# Altium schematic sheet Master_sheet.SchDoc
size A4; SheetNumber: 1; SheetTotal: 1
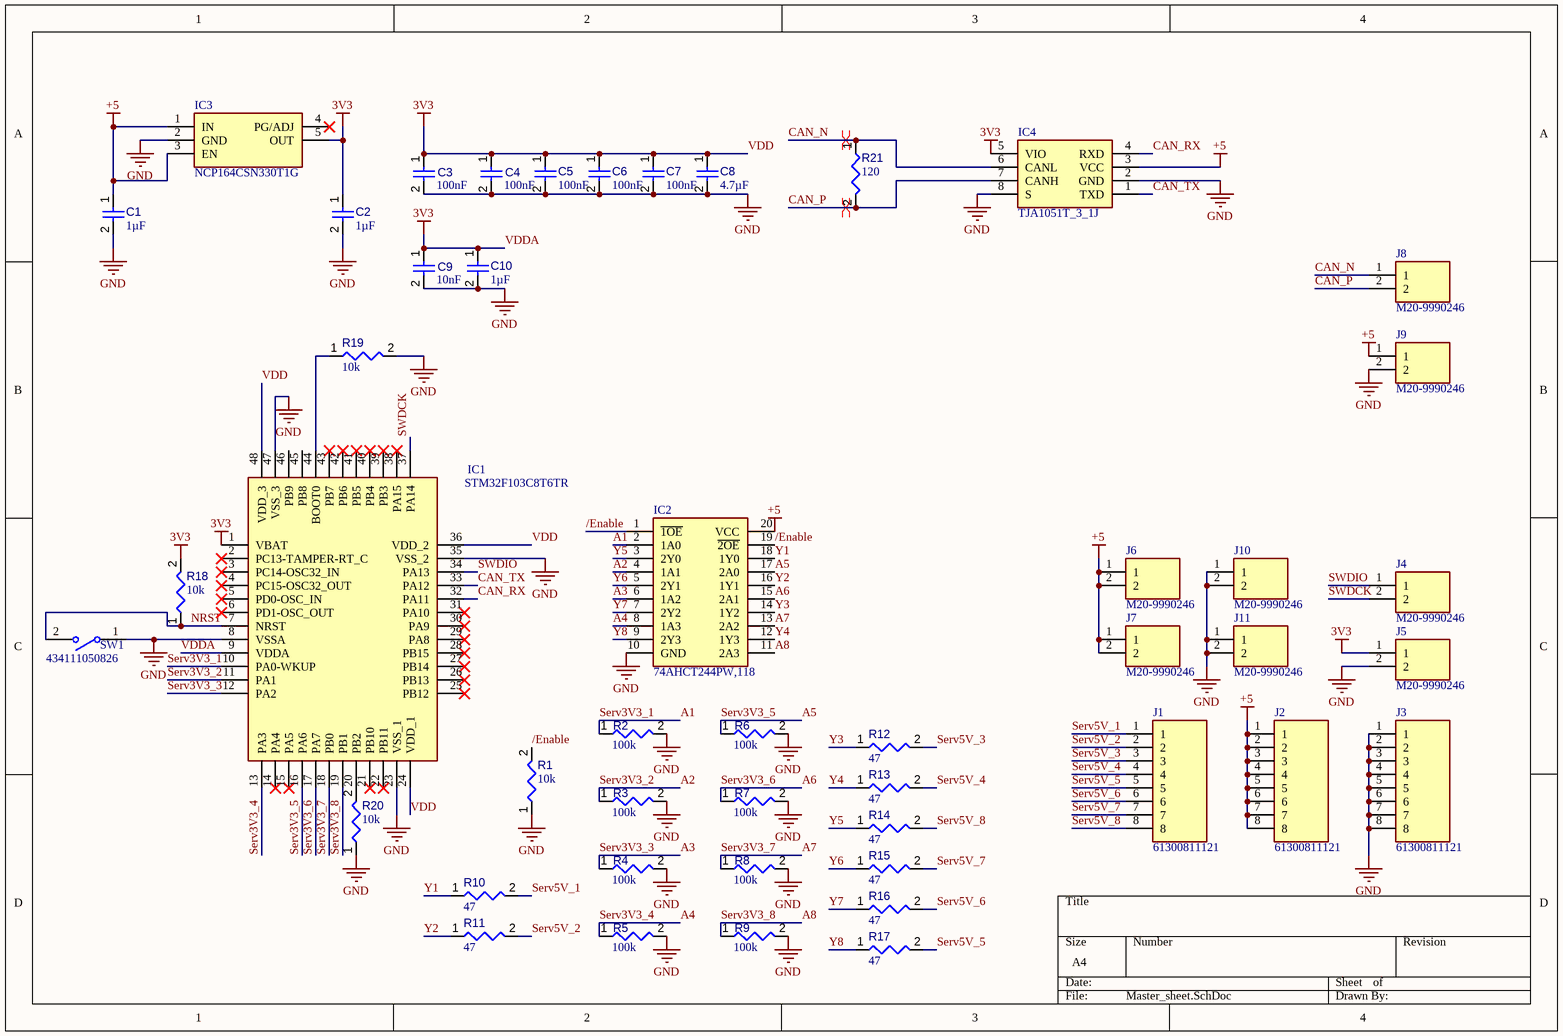
[diagram p0: Master_sheet.SchDoc]

## Parts
C1  value 1µF  [CAPC1608X94X35NL15T15]  (hidden comment: Capacitor 1 uF +/- 10% 16 V 0603)
C2  value 1µF  [CAPC1608X94X35NL15T15]  (hidden comment: Capacitor 1 uF +/- 10% 16 V 0603)
C3  value 100nF  [CAPC1608X94X35NL15T15]  (hidden comment: Capacitor 1 uF +/- 10% 16 V 0603)
C4  value 100nF  [CAPC1608X94X35NL15T15]  (hidden comment: Capacitor 1 uF +/- 10% 16 V 0603)
C5  value 100nF  [CAPC1608X94X35NL15T15]  (hidden comment: Capacitor 1 uF +/- 10% 16 V 0603)
C6  value 100nF  [CAPC1608X94X35NL15T15]  (hidden comment: Capacitor 1 uF +/- 10% 16 V 0603)
C7  value 100nF  [CAPC1608X94X35NL15T15]  (hidden comment: Capacitor 1 uF +/- 10% 16 V 0603)
C8  value 4.7µF  [CAPC1608X94X35NL15T15]  (hidden comment: Capacitor 1 uF +/- 10% 16 V 0603)
C9  value 10nF  [CAPC1608X94X35NL15T15]  (hidden comment: Capacitor 1 uF +/- 10% 16 V 0603)
C10  value 1µF  [CAPC1608X94X35NL15T15]  (hidden comment: Capacitor 1 uF +/- 10% 16 V 0603)
IC1  STM32F103C8T6TR  [QFP50P900X900X160-48N]
IC2  74AHCT244PW,118  [SOP65P640X110-20N]
IC3  NCP164CSN330T1G  [SOT95P275X110-5N]
IC4  TJA1051T_3_1J  [SOIC127P600X175-8N]
J1  61300811121  [HDRV8W64P0X254_1X8_2032X254X854P]
J2  61300811121  [HDRV8W64P0X254_1X8_2032X254X854P]
J3  61300811121  [HDRV8W64P0X254_1X8_2032X254X854P]
J4  M20-9990246  [HDRV2W66P0X254_1X2_508X254X874P]
J5  M20-9990246  [HDRV2W66P0X254_1X2_508X254X874P]
J6  M20-9990246  [HDRV2W66P0X254_1X2_508X254X874P]
J7  M20-9990246  [HDRV2W66P0X254_1X2_508X254X874P]
J8  M20-9990246  [HDRV2W66P0X254_1X2_508X254X874P]
J9  M20-9990246  [HDRV2W66P0X254_1X2_508X254X874P]
J10  M20-9990246  [HDRV2W66P0X254_1X2_508X254X874P]
J11  M20-9990246  [HDRV2W66P0X254_1X2_508X254X874P]
R1  value 10k  [RESC1608X55X25ML10T15]  (hidden comment: Resistor 100k +/-1% 0603 100 mW)
R2  value 100k  [RESC1608X55X25ML10T15]  (hidden comment: Resistor 100k +/-1% 0603 100 mW)
R3  value 100k  [RESC1608X55X25ML10T15]  (hidden comment: Resistor 100k +/-1% 0603 100 mW)
R4  value 100k  [RESC1608X55X25ML10T15]  (hidden comment: Resistor 100k +/-1% 0603 100 mW)
R5  value 100k  [RESC1608X55X25ML10T15]  (hidden comment: Resistor 100k +/-1% 0603 100 mW)
R6  value 100k  [RESC1608X55X25ML10T15]  (hidden comment: Resistor 100k +/-1% 0603 100 mW)
R7  value 100k  [RESC1608X55X25ML10T15]  (hidden comment: Resistor 100k +/-1% 0603 100 mW)
R8  value 100k  [RESC1608X55X25ML10T15]  (hidden comment: Resistor 100k +/-1% 0603 100 mW)
R9  value 100k  [RESC1608X55X25ML10T15]  (hidden comment: Resistor 100k +/-1% 0603 100 mW)
R10  value 47  [RESC1608X55X25ML10T15]  (hidden comment: Resistor 100k +/-1% 0603 100 mW)
R11  value 47  [RESC1608X55X25ML10T15]  (hidden comment: Resistor 100k +/-1% 0603 100 mW)
R12  value 47  [RESC1608X55X25ML10T15]  (hidden comment: Resistor 100k +/-1% 0603 100 mW)
R13  value 47  [RESC1608X55X25ML10T15]  (hidden comment: Resistor 100k +/-1% 0603 100 mW)
R14  value 47  [RESC1608X55X25ML10T15]  (hidden comment: Resistor 100k +/-1% 0603 100 mW)
R15  value 47  [RESC1608X55X25ML10T15]  (hidden comment: Resistor 100k +/-1% 0603 100 mW)
R16  value 47  [RESC1608X55X25ML10T15]  (hidden comment: Resistor 100k +/-1% 0603 100 mW)
R17  value 47  [RESC1608X55X25ML10T15]  (hidden comment: Resistor 100k +/-1% 0603 100 mW)
R18  value 10k  [RESC1608X55X25ML10T15]  (hidden comment: Resistor 100k +/-1% 0603 100 mW)
R19  value 10k  [RESC1608X55X25ML10T15]  (hidden comment: Resistor 100k +/-1% 0603 100 mW)
R20  value 10k  [RESC1608X55X25ML10T15]  (hidden comment: Resistor 100k +/-1% 0603 100 mW)
R21  value 120  [RESC1608X55X25ML10T15]  (hidden comment: Resistor 100k +/-1% 0603 100 mW)
SW1  434111050826  [434111050826]

## Nets
+5: C1.1 IC2.20(VCC) IC3.1(IN) IC3.3(EN) IC4.3(VCC) J2.1 J2.2 J2.3 J2.4 J2.5 J2.6 J2.7 J2.8 J6.1 J6.2 J7.1 J7.2 J9.1
GND: C1.2 C2.2 C3.2 C4.2 C5.2 C6.2 C7.2 C8.2 C9.2 C10.2 IC1.8(VSSA) IC1.23(VSS_1) IC1.35(VSS_2) IC1.47(VSS_3) IC2.10(GND) IC3.2(GND) IC4.2(GND) IC4.8(S) J3.1 J3.2 J3.3 J3.4 J3.5 J3.6 J3.7 J3.8 J5.2 J9.2 J10.1 J10.2 J11.1 J11.2 R1.1 R2.2 R3.2 R4.2 R5.2 R6.2 R7.2 R8.2 R9.2 R19.2 R20.1 SW1.1
VDD: C2.1 C3.1 C4.1 C5.1 C6.1 C7.1 C8.1 C9.1 C10.1 IC1.1(VBAT) IC1.9(VDDA) IC1.24(VDD_1) IC1.36(VDD_2) IC1.48(VDD_3) IC3.5(OUT) IC4.5(VIO) J5.1 R18.2  [also labelled 3V3, VDDA]
/Enable: IC2.1(~{1OE}) IC2.19(~{2OE}) R1.2
A1: IC1.10(PA0-WKUP) IC2.2(1A0) R2.1  [also labelled Serv3V3_1]
A2: IC1.11(PA1) IC2.4(1A1) R3.1  [also labelled Serv3V3_2]
A3: IC1.12(PA2) IC2.6(1A2) R4.1  [also labelled Serv3V3_3]
A4: IC1.13(PA3) IC2.8(1A3) R5.1  [also labelled Serv3V3_4]
A5: IC1.16(PA6) IC2.17(2A0) R6.1  [also labelled Serv3V3_5]
A6: IC1.17(PA7) IC2.15(2A1) R7.1  [also labelled Serv3V3_6]
A7: IC1.18(PB0) IC2.13(2A2) R8.1  [also labelled Serv3V3_7]
A8: IC1.19(PB1) IC2.11(2A3) R9.1  [also labelled Serv3V3_8]
CAN_N: IC4.6(CANL) J8.1 R21.1
CAN_P: IC4.7(CANH) J8.2 R21.2
CAN_RX: IC1.32(PA11) IC4.4(RXD)
CAN_TX: IC1.33(PA12) IC4.1(TXD)
NRST: IC1.7(NRST) R18.1 SW1.2
Serv5V_1: J1.1 R10.2
Serv5V_2: J1.2 R11.2
Serv5V_3: J1.3 R12.2
Serv5V_4: J1.4 R13.2
Serv5V_5: J1.5 R17.2
Serv5V_6: J1.6 R16.2
Serv5V_7: J1.7 R15.2
Serv5V_8: J1.8 R14.2
SWDCK: IC1.37(PA14) J4.2
SWDIO: IC1.34(PA13) J4.1
Y1: IC2.18(1Y0) R10.1
Y2: IC2.16(1Y1) R11.1
Y3: IC2.14(1Y2) R12.1
Y4: IC2.12(1Y3) R13.1
Y5: IC2.3(2Y0) R14.1
Y6: IC2.5(2Y1) R15.1
Y7: IC2.7(2Y2) R16.1
Y8: IC2.9(2Y3) R17.1
NetIC1_20: IC1.20(PB2) R20.2
NetIC1_44: IC1.44(BOOT0) R19.1

Not connected (* = marked no-connect by the designer): IC1 2(PC13-TAMPER-RT_C)* 3(PC14-OSC32_IN)* 4(PC15-OSC32_OUT)* 5(PD0-OSC_IN)* 6(PD1-OSC_OUT)* 14(PA4)* 15(PA5)* 21(PB10)* 22(PB11)* 25(PB12)* 26(PB13)* 27(PB14)* 28(PB15)* 29(PA8)* 30(PA9)* 31(PA10)* 38(PA15)* 39(PB3)* 40(PB4)* 41(PB5)* 42(PB6)* 43(PB7)* 45(PB8) 46(PB9); IC3 4(PG/ADJ)*

## Layout directives
differential pair: CAN_N, CAN_P

## Library data of the parts
C1-C10 = CMP-001-00003-6: Chip Capacitor, 1 uF, +/- 10%, 16 V, 0603 (1608 Metric); Voltage Rating: 16V; Capacitor Type: Ceramic; Max Operating Temperature: 125°C; Pins: 2; Tolerance: 10%; Min Operating Temperature: -55°C; RoHS Compliant: True; Mounting Technology: SM; Case/Package: 0603
IC1 = STM32F103C8T6TR: Integrated Circuit; Manufacturer_Name: STMicroelectronics; Datasheet Link: http://media.digikey.com/pdf/Data%20Sheets/ST%20Microelectronics%20PDFS/STM32F103x8,B.pdf; Height: 1.6mm; Manufacturer_Part_Number: STM32F103C8T6TR; Mouser Part Number: 511-STM32F103C8T6TR; Mouser Price/Stock: https://www.mouser.co.uk/ProductDetail/STMicroelectronics/STM32F103C8T6TR?qs=5HwTSiuA5HDxFj62n06yag%3D%3D; Arrow Part Number: STM32F103C8T6TR; Arrow Price/Stock: https://www.arrow.com/en/products/stm32f103c8t6tr/stmicroelectronics?utm_currency=USD&region=nac
IC2 = 74AHCT244PW,118: Integrated Circuit; Manufacturer_Name: Nexperia; Datasheet Link: https://assets.nexperia.com/documents/data-sheet/74AHC_AHCT244.pdf; Height: 1.1mm; Manufacturer_Part_Number: 74AHCT244PW,118; Mouser Part Number: 771-AHCT244PW118; Mouser Price/Stock: https://www.mouser.co.uk/ProductDetail/Nexperia/74AHCT244PW118?qs=P62ublwmbi%252BwpHKVMKyyhA%3D%3D; Arrow Part Number: 74AHCT244PW,118; Arrow Price/Stock: https://www.arrow.com/en/products/74ahct244pw118/nexperia?region=nac
IC3 = NCP164CSN330T1G: Integrated Circuit; Manufacturer_Name: onsemi; Datasheet Link: https://componentsearchengine.com/Datasheets/2/NCP164CSN330T1G.pdf; Height: 1.1mm; Manufacturer_Part_Number: NCP164CSN330T1G; Mouser Part Number: 863-NCP164CSN330T1G; Mouser Price/Stock: https://www.mouser.co.uk/ProductDetail/onsemi/NCP164CSN330T1G?qs=xZ%2FP%252Ba9zWqbi%2FAyy5UtoRw%3D%3D; Arrow Part Number: NCP164CSN330T1G; Arrow Price/Stock: https://www.arrow.com/en/products/ncp164csn330t1g/on-semiconductor?utm_currency=USD&region=nac
IC4 = TJA1051T_3_1J: Integrated Circuit; Manufacturer_Name: NXP; Manufacturer_Part_Number: TJA1051T/3/1J; Datasheet Link: http://www.nxp.com/docs/en/data-sheet/TJA1051.pdf; Height: 1.75mm; Mouser Part Number: 771-TJA1051T/3/1J; Mouser Price/Stock: https://www.mouser.co.uk/ProductDetail/NXP-Semiconductors/TJA1051T-3-1J?qs=Yna0arPQ0CSsef2%2FqMQJxA%3D%3D; Arrow Part Number: TJA1051T/3/1J; Arrow Price/Stock: https://www.arrow.com/en/products/tja1051t31j/nxp-semiconductors?utm_currency=USD&region=nac
J1-J3 = 61300811121: Connector; Manufacturer_Name: Wurth Elektronik; Datasheet Link: http://katalog.we-online.de/em/datasheet/6130xx11121.pdf; Height: 8.54mm; Manufacturer_Part_Number: 61300811121; Mouser Part Number: 710-61300811121; Mouser Price/Stock: https://www.mouser.co.uk/ProductDetail/Wurth-Elektronik/61300811121?qs=PhR8RmCirEZRdx%252BVlEmRRA%3D%3D
J4-J11 = M20-9990246: Connector; Manufacturer_Name: Harwin; Datasheet Link: https://cdn.harwin.com/pdfs/M20-999.pdf; Height: 8.74mm; Manufacturer_Part_Number: M20-9990246; Mouser Part Number: 855-M20-9990246; Mouser Price/Stock: https://www.mouser.co.uk/ProductDetail/Harwin/M20-9990246?qs=Jph8NoUxIfWjw4WmyRvzag%3D%3D
R1-R21 = CMP-009-00023-5: Chip Resistor, 100 KOhm, +/- 1%, 0.1 W, -55 to 155 degC, 0603 (1608 Metric); Voltage Rating: 50V; Power: 100mW; Max Operating Temperature: 155°C; RoHS Compliant: True; Tolerance: 1%; Pins: 2; Case/Package: 0603; Mounting Technology: SM; Min Operating Temperature: -55°C
SW1 = CMP-011-00014-1: Keypad Switch, 1 Switches, SPST, Momentary-tactile, 0.05A, 12VDC, 3.24N, Solder Terminal, Surface Mount-straight; Min Operating Temperature: -40°C; Mounting Technology: Surface Mount; RoHS Compliant: Yes; Max Operating Temperature: 85°C